# EAGLE design ESP-32-VEZERLO-V1 (EAGLE 6.3)
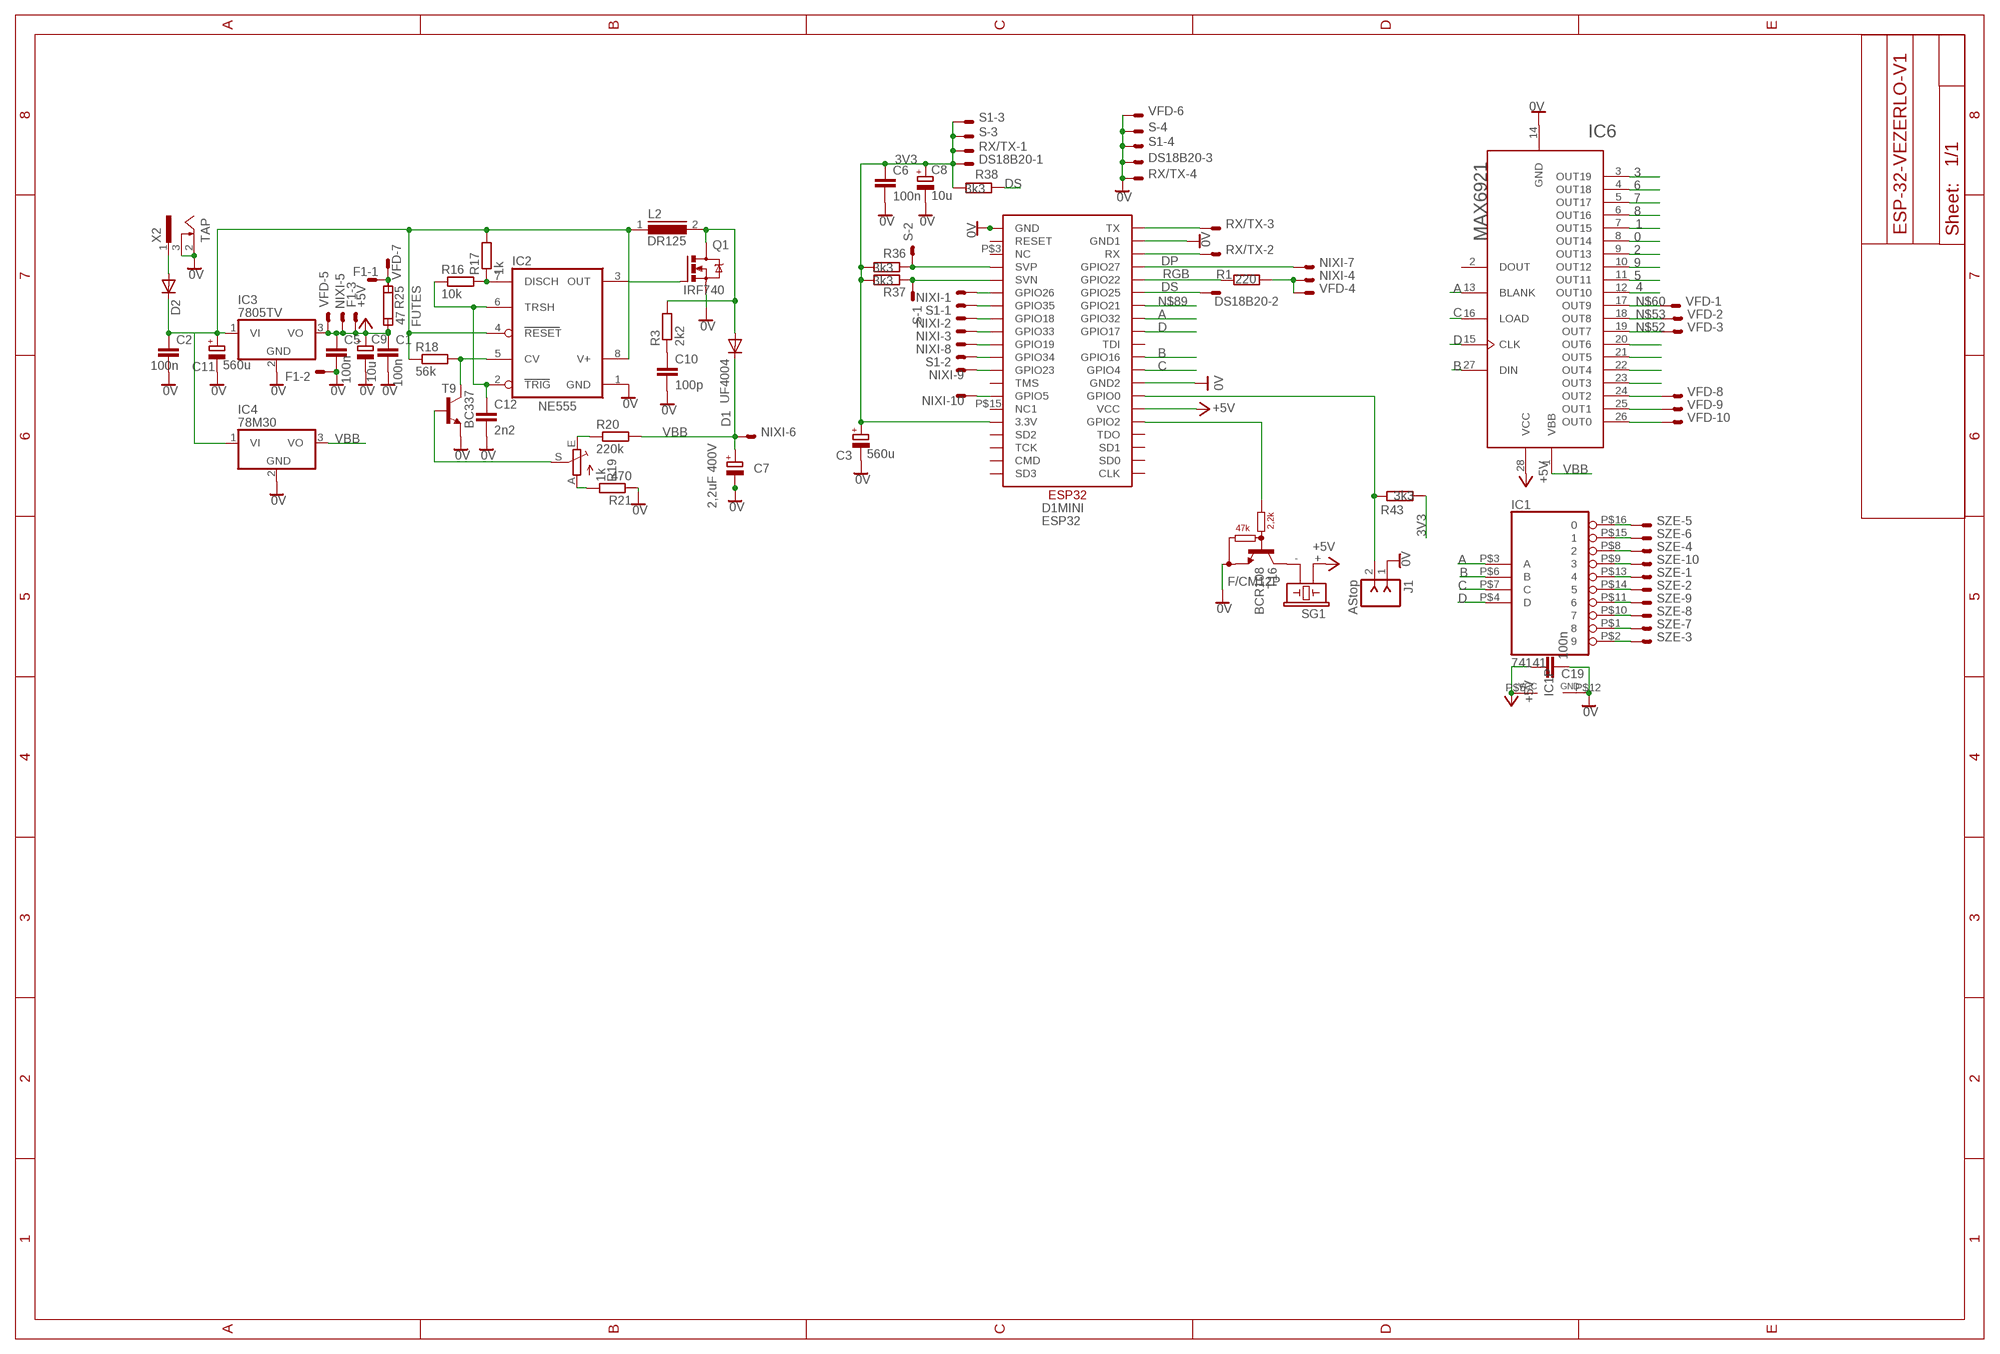
[diagram p0: schematic, sheet 1]

## Parts
C1  100n  C0603  [0603]
C2  100n  C0603  [0603]
C3  560u  CPOL-EUE5-8.5  [E5-8,5]
C5  100n  C0603  [0603]
C6  100n  C0603  [0603]
C7  2,2uF 400V  CPOL-EUE2.5-7  [E2,5-7]
C8  10u  CPOL-EUE2.5-5  [E2,5-5]
C9  10u  CPOL-EUE2.5-5  [E2,5-5]
C10  100p  C-EU050-024X044  [C050-024X044]
C11  560u  CPOL-EUE5-8.5  [E5-8,5]
C12  2n2  C-EUC0603  [C0603]
C19  100n  C0603  [0603]
D1  UF4004  BA221  [DO35-10]
D1MINI  ESP32  ESP32-2X20  [ESP32-2X20]
D2  DIODE-SOD123  [SOD123]
DS18B20  PAD3  [PAD3]
F1  PAD3  [PAD3]
FUTES  47  R-EU_0207/10  [0207/10]
IC1  74141  [DIL16SMD]
IC2  NE555  ICM7555  [DIL08]
IC3  7805TV  [TO220V]
IC4  78M30  7805TV  [TO220V]
IC6  MAX6921  MAX6921SOIC28W  [SO-28W]
J1  AStop  F-1X02-SIP-100-32  [SIP-100-02-32]
L2  DR125  [DR125]
NIXI  PAD10  [PAD10]
Q1  IRF740  [TO220BV]
R1  220  R0603  [0603]
R3  2k2  R-EU_0204/7  [0204/7]
R16  10k  R-EU_R0603  [R0603]
R17  1k  R-EU_R0603  [R0603]
R18  56k  R-EU_R0603  [R0603]
R19  1k  TRIM_EU-CA6H  [CA6H]
R20  220k  R-EU_0204/7  [0204/7]
R21  470  R-EU_0204/7  [0204/7]
R25  RCA0001  [CA0001]
R36  3k3  R0603  [0603]
R37  3k3  R0603  [0603]
R38  3k3  R0603  [0603]
R43  3k3  R0603  [0603]
RX/TX  PAD4  [PAD4]
S  PAD4  [PAD4]
S1  PAD4  [PAD4]
SG1  F/CM12P  [F/CM12P]
SZE  PAD10  [PAD10]
T9  BC337  BC847-NPN-SOT23-BEC  [SOT23-BEC]
T16  BCR108  [SOT23-BEC]
VFD  PAD10  [PAD10]
X2  TAP  [TAP]

## Nets
0: IC1.P$16 IC6.8(OUT14) SZE.P$5
0V: C1.2 C2.2 C3.- C5.2 C6.2 C7.- C8.- C9.- C10.2 C11.- C12.2 C19.2 D1MINI.P$1(GND) D1MINI.P$22(GND1) D1MINI.P$33(GND2) DS18B20.P$3 F1.P$2 IC1.P$12(GND) IC2.1(GND) IC3.2(GND) IC4.2(GND) IC6.14(GND) J1.1 Q1.S R21.1 RX/TX.P$4 S1.P$4 S.P$4 T9.E T16.E VFD.P$6 X2.2 X2.3
1: IC1.P$15 IC6.7(OUT15) SZE.P$6
2: IC1.P$8 IC6.9(OUT13) SZE.P$4
3: IC1.P$9 IC6.3(OUT19) SZE.P$10
3V3: C3.+ C6.1 C8.+ D1MINI.P$16(3.3V) DS18B20.P$1 R36.2 R37.2 R38.2 R43.2 RX/TX.P$1 S1.P$3 S.P$3
4: IC1.P$13 IC6.12(OUT10) SZE.P$1
5: IC1.P$14 IC6.11(OUT11) SZE.P$2
6: IC1.P$11 IC6.4(OUT18) SZE.P$9
7: IC1.P$10 IC6.5(OUT17) SZE.P$8
8: IC1.P$1 IC6.6(OUT16) SZE.P$7
9: IC1.P$2 IC6.10(OUT12) SZE.P$3
+5V: C1.1 C5.1 C9.+ C19.1 D1MINI.P$35(VCC) F1.P$3 FUTES.1 IC1.P$5(VCC) IC3.3(VO) IC6.28(VCC) NIXI.P$5 R25.1 SG1.+ VFD.P$5
A: D1MINI.P$28(GPIO32) IC1.P$3(A) IC6.13(BLANK)
B: D1MINI.P$31(GPIO16) IC1.P$6(B) IC6.27(DIN)
C: D1MINI.P$32(GPIO4) IC1.P$7(C) IC6.16(LOAD)
D: D1MINI.P$29(GPIO17) IC1.P$4(D) IC6.15(CLK)
DP: D1MINI.P$24(GPIO27) NIXI.P$7
DS: D1MINI.P$26(GPIO25) DS18B20.P$2 R38.1
N$1: D1MINI.P$21(TX) RX/TX.P$3
N$2: D1MINI.P$6(GPIO26) NIXI.P$1
N$3: IC6.26(OUT0) VFD.P$10
N$4: IC6.25(OUT1) VFD.P$9
N$6: F1.P$1 FUTES.2 R25.2 VFD.P$7
N$7: D1MINI.P$8(GPIO18) NIXI.P$2
N$8: IC6.24(OUT2) VFD.P$8
N$10: NIXI.P$4 R1.1 VFD.P$4
N$18: R19.E R20.1
N$20: R19.A R21.2
N$22: IC2.3(OUT) Q1.G
N$23: IC2.7(DISCH) R16.2 R17.1
N$24: C12.1 IC2.2(TRIG) IC2.6(TRSH) R16.1
N$26: IC2.5(CV) R18.2 T9.C
N$27: C10.1 R3.1
N$28: D1MINI.P$5(SVN) R37.1 S.P$1
N$43: IC6.23(OUT3)
N$44: D1.A L2.2 Q1.D R3.2
N$46: D1MINI.P$7(GPIO35) S1.P$1
N$49: IC6.22(OUT4)
N$50: IC6.21(OUT5)
N$51: IC6.20(OUT6)
N$52: IC6.19(OUT7) VFD.P$3
N$53: IC6.18(OUT8) VFD.P$2
N$60: IC6.17(OUT9) VFD.P$1
N$70: D2.A X2.1
N$72: D1MINI.P$4(SVP) R36.1 S.P$2
N$73: D1MINI.P$9(GPIO33) NIXI.P$3
N$74: D1MINI.P$10(GPIO19) NIXI.P$8
N$75: D1MINI.P$12(GPIO23) NIXI.P$9
N$76: D1MINI.P$14(GPIO5) NIXI.P$10
N$77: D1MINI.P$36(GPIO2) T16.B
N$79: D1MINI.P$11(GPIO34) S1.P$2
N$80: D1MINI.P$23(RX) RX/TX.P$2
N$89: D1MINI.P$27(GPIO21)
N$92: C2.1 C11.+ D2.C IC2.4(RESET) IC2.8(V+) IC3.1(VI) IC4.1(VI) L2.1 R17.2 R18.1
N$94: SG1.- T16.C
N$96: D1MINI.P$34(GPIO0) J1.2 R43.1
N$119: R19.S T9.B
RGB: D1MINI.P$25(GPIO22) R1.2
VBB: C7.+ D1.C IC4.3(VO) IC6.1(VBB) NIXI.P$6 R20.2
Unconnected: D1MINI.P$2(RESET) D1MINI.P$3(NC) D1MINI.P$13(TMS) D1MINI.P$15(NC1) D1MINI.P$17(SD2) D1MINI.P$18(TCK) D1MINI.P$19(CMD) D1MINI.P$20(SD3) D1MINI.P$30(TDI) D1MINI.P$37(TDO) D1MINI.P$38(SD1) D1MINI.P$39(SD0) D1MINI.P$40(CLK) IC6.2(DOUT)

## Library data of the parts
C1 C2 C5 C6 C19 =  Zozo:C
C3 C7-C9 C11 = resistor:CPOL-EU: POLARIZED CAPACITOR, European symbol
C10 C12 = resistor:C-EU: CAPACITOR, European symbol
D1 = diode:BA221: DIODE high speed (Philips)
D1MINI = ESP32:ESP32-2X20
D2 = diode:DIODE-: DIODE
DS18B20 F1 = tuskesor:PAD3
FUTES R3 R16-R18 R20 R21 = resistor:R-EU_: RESISTOR, European symbol
IC1 = 74xx-eu:74*141: BCD to decimal DECODER/DRIVER
IC2 = maxim1:ICM7555: TIMER; MF: MAXIM; MPN: ICM7555IPA+; OC_FARNELL: 9663762; OC_NEWARK: 68K4387
IC3 IC4 = linear:78*: Positive VOLTAGE REGULATOR Source: http://cache.national.com/ds/LM/LM78L05.pdf http://www.fairchildsemi.com/ds/LM/LM7805.pdf
IC6 = JVN:MAX6921
J1 = con-headers-jp:F-1X02-: FEMALE HEADER
L2 = inductors:DR125: High Power Density, High Efficiency, Shielded Inductors Source: coiltronics_dr_series.pdf
NIXI SZE VFD = tuskesor:PAD10
Q1 = transistor-power:IRF740: N-CHANNEL MOS FET
R1 R36-R38 R43 =  Zozo:R
R19 = pot:TRIM_EU-: POTENTIOMETER
R25 = resistor-power:R: Power Resitor; OC_FARNELL: unknown; OC_NEWARK: unknown
RX/TX S S1 = tuskesor:PAD4
SG1 = buzzer:F/CM12P: BUZZER Source: Buerklin; OC_FARNELL: unknown; OC_NEWARK: unknown
T9 = transistor:*-NPN-: NPN Transistror BF959 corrected 2008.03.06
T16 = digital-transistors:BCR108: NPN Silicon Digital Transistor 50V 0,1A 0,2W
X2 = con-conrad:TAP

## Board
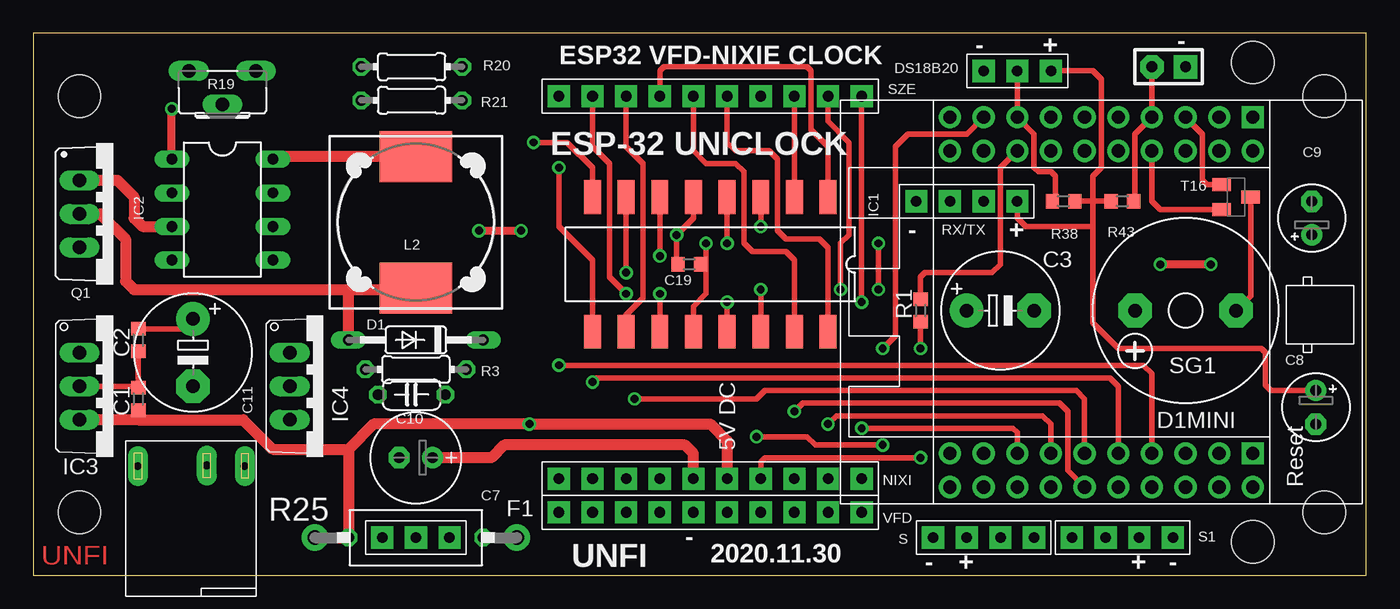
[diagram p1: board, top side]
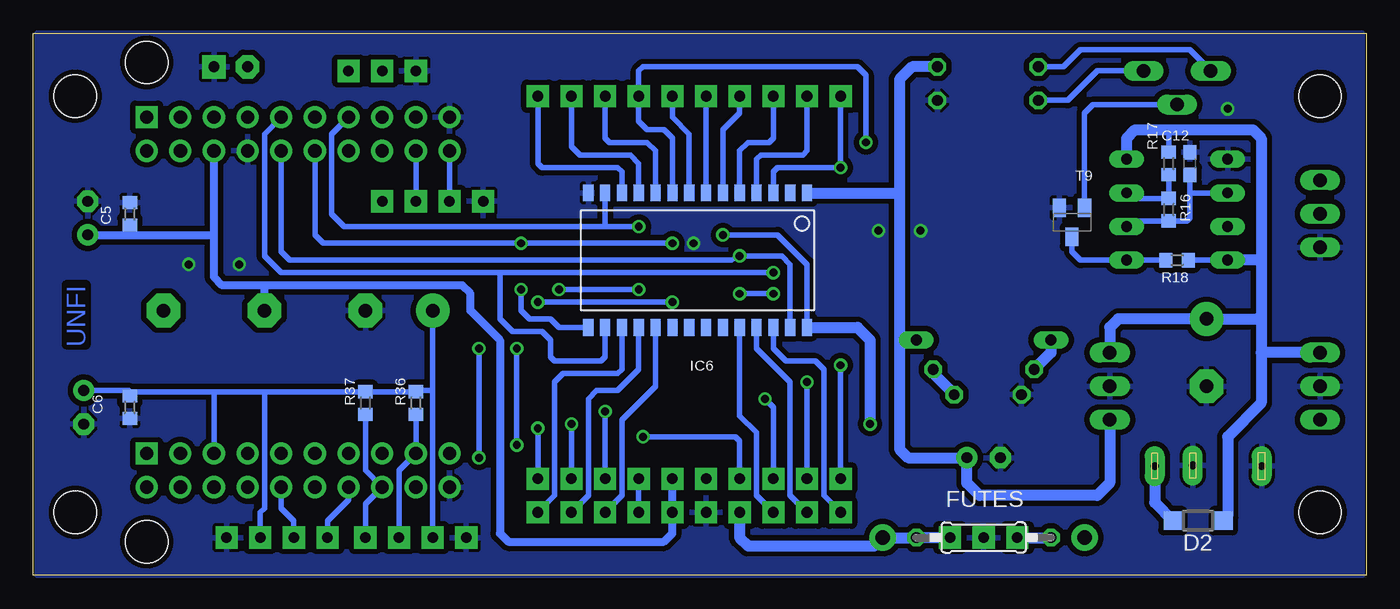
[diagram p2: board, bottom side, seen from below]

Size 100.65 x 40.96 mm. Coordinates in mm from the lower left corner, seen from the top.
Outline: 0,0 100.65,0 100.65,40.96 0,40.96 0,0
Copper layers (1*16): Top 0.035mm / dielectric 1.5mm / Bottom 0.035mm
Design rules "default *": minimum track width 10mil, minimum drill 24mil, track to track 8mil, track to pad 8mil, pad to pad 8mil, via to via 8mil, smd to smd 8mil, copper to edge 0mil, drill to drill 8mil, minimum pad ring 10mil, minimum via ring 8mil, stop-mask expansion 4mil, vias tented up to drill 0mil, thermal gap 10mil
Holes 3.2 mm at 3.49,36.2 3.49,4.76 92.07,2.54 92.07,38.74 97.47,36.2 97.47,4.76

### Footprints (pad centres in the part's own frame; a part is rotated, then mirrored left to right if it is on the bottom)
0603 = smd 1 x 1.1: 1 -0.85,0; 2 0.85,0
E5-8,5 = drill 1.016 pad 2.54: + -2.54,0 | drill 1.016 pad 2.54 octagon: - 2.54,0
E2,5-7 = drill 0.813 pad 1.6: + -1.27,0 | drill 0.813 pad 1.6 octagon: - 1.27,0
E2,5-5 = drill 0.813 pad 1.6: + -1.27,0 | drill 0.813 pad 1.6 octagon: - 1.27,0
C050-024X044 = drill 0.813 octagon: 1 -2.54,0; 2 2.54,0
C0603 = smd 1.1 x 1: 1 -0.85,0; 2 0.85,0
DO35-10 = drill 0.813 long: A 5.08,0; C -5.08,0
ESP32-2X20 = drill 1 pad 1.676: P$1 -12.7,10.16; P$2 -10.16,10.16; P$3 -12.7,7.62; P$4 -10.16,7.62; P$5 -12.7,5.08; P$6 -10.16,5.08; P$7 -12.7,2.54; P$8 -10.16,2.54; P$9 -12.7,0; P$10 -10.16,0; P$11 -12.7,-2.54; P$12 -10.16,-2.54; P$13 -12.7,-5.08; P$14 -10.16,-5.08; P$15 -12.7,-7.62; P$16 -10.16,-7.62; P$17 -12.7,-10.16; P$18 -10.16,-10.16; P$19 -12.7,-12.7; P$21 12.7,10.16; P$22 15.24,10.16; P$23 12.7,7.62; P$24 15.24,7.62; P$25 12.7,5.08; P$26 15.24,5.08; P$27 12.7,2.54; P$28 15.24,2.54; P$29 12.7,0; P$30 15.24,0; P$31 12.7,-2.54; P$32 15.24,-2.54; P$33 12.7,-5.08; P$34 15.24,-5.08; P$35 12.7,-7.62; P$36 15.24,-7.62; P$37 12.7,-10.16; P$38 15.24,-10.16; P$39 12.7,-12.7 | drill 1 pad 1.676 square: P$20 -10.16,-12.7; P$40 15.24,-12.7
SOD123 = smd 1.4 x 1.4: A 1.9,0; C -1.9,0
PAD3 = drill 0.8 pad 1.676 square: P$1 0,0; P$2 2.54,0; P$3 5.08,0
0207/10 = drill 0.813 octagon: 1 -5.08,0; 2 5.08,0
DIL16SMD = smd 1.27 x 2.54: P$1 0,0; P$2 2.54,0; P$3 5.08,0; P$4 7.62,0; P$5 10.16,0; P$6 12.7,0; P$7 15.24,0; P$8 17.78,0; P$9 17.78,10.16; P$10 15.24,10.16; P$11 12.7,10.16; P$12 10.16,10.16; P$13 7.62,10.16; P$14 5.08,10.16; P$15 2.54,10.16; P$16 0,10.16
DIL08 = drill 0.813 long: 1 -3.81,-3.81; 2 -1.27,-3.81; 3 1.27,-3.81; 4 3.81,-3.81; 5 3.81,3.81; 6 1.27,3.81; 7 -1.27,3.81; 8 -3.81,3.81
TO220V = drill 1.016 long: 1 -2.54,-2.54; 2 0,-2.54; 3 2.54,-2.54
SO-28W = smd 0.762 x 1.27: 1 -8.255,-5.08; 2 -6.985,-5.08; 3 -5.715,-5.08; 4 -4.445,-5.08; 5 -3.175,-5.08; 6 -1.905,-5.08; 7 -0.635,-5.08; 8 0.635,-5.08; 9 1.905,-5.08; 10 3.175,-5.08; 11 4.445,-5.08; 12 5.715,-5.08; 13 6.985,-5.08; 14 8.255,-5.08; 15 8.255,5.08; 16 6.985,5.08; 17 5.715,5.08; 18 4.445,5.08; 19 3.175,5.08; 20 1.905,5.08; 21 0.635,5.08; 22 -0.635,5.08; 23 -1.905,5.08; 24 -3.175,5.08; 25 -4.445,5.08; 26 -5.715,5.08; 27 -6.985,5.08; 28 -8.255,5.08
SIP-100-02-32 = drill 0.813 pad 1.778 square: 1 -1.27,0 | drill 0.813 pad 1.778 octagon: 2 1.27,0
DR125 = smd 3.85 x 5.5: 1 -4.975,0; 2 4.975,0
PAD10 = drill 0.8 pad 1.676 square: P$1 0,0; P$2 2.54,0; P$3 5.08,0; P$4 7.62,0; P$5 10.16,0; P$6 12.7,0; P$7 15.24,0; P$8 17.78,0; P$9 20.32,0; P$10 22.86,0
TO220BV = drill 1.016 long: D 0,-2.54; G -2.54,-2.54; S 2.54,-2.54
0204/7 = drill 0.813 octagon: 1 -3.81,0; 2 3.81,0
R0603 = smd 1 x 1.1: 1 -0.85,0; 2 0.85,0
CA6H = drill 1.016 long: A -2.54,0; E 2.54,0; S 0,2.54
CA0001 = drill 1.1 pad 2: 1 -7.62,0; 2 7.62,0
PAD4 = drill 0.8 pad 1.676 square: P$1 0,0; P$2 2.54,0; P$3 5.08,0; P$4 7.62,0
F/CM12P = drill 1.016 pad 2.54 octagon: + 3.81,0; - -3.81,0
SOT23-BEC = smd 1 x 1.4: B -0.95,-1.1; C 0,1.1; E 0.95,-1.1
TAP = drill 0.6 pad 1.5 long: 1 -4.55,0; 2 3.525,0; 3 -1.676,-0.04

### Placement (x,y rotation side)
C1  7.94,13.34 90 top
C2  7.94,17.78 270 top
C3  73.02,20 0 top
C5  93.34,27.3 90 bottom
C6  93.34,12.7 270 bottom
C7  28.89,8.89 180 top
C8  96.84,12.7 270 top
C9  96.52,26.99 90 top
C10  28.57,13.65 180 top
C11  12.07,16.83 270 top
C12  13.34,31.12 90 bottom
C19  49.53,23.5 0 top
D1  28.89,17.78 180 top
D1MINI  79.38,19.37 90 top
D2  12.7,4.13 180 bottom
DS18B20  76.83,38.1 180 top
F1  31.43,2.86 180 top
FUTES  28.89,2.86 180 bottom
IC1  60.01,28.58 180 top
IC2  14.29,27.62 270 top
IC3  6.03,14.29 270 top
IC4  21.91,14.29 270 top
IC6  50.48,23.81 180 bottom
J1  85.72,38.42 180 top
L2  28.89,26.67 270 top
NIXI  62.55,7.3 180 top
Q1  6.03,27.3 270 top
R1  66.99,20 90 top
R3  28.89,15.56 180 top
R16  14.92,27.62 90 bottom
R17  14.92,31.12 90 bottom
R18  14.29,23.81 180 bottom
R19  14.29,38.1 180 top
R20  28.57,38.42 0 top
R21  28.57,35.88 180 top
R25  28.89,2.86 0 top
R36  71.75,13.02 90 bottom
R37  75.56,13.02 90 bottom
R38  77.79,28.26 0 top
R43  82.23,28.26 180 top
RX/TX  74.3,28.26 180 top
S  75.56,2.86 180 top
S1  78.42,2.86 0 top
SG1  86.99,20 180 top
SZE  62.55,36.2 180 top
T9  22.22,26.67 180 bottom
T16  90.8,28.58 270 top
VFD  62.55,4.76 180 top
X2  11.43,8.26 180 top

### Tracks (layer width: path | path; a pad name or v marks a point on that pad's centre or on a via)
0
  Top 0.406: IC1.P$16 60.01,24.77 59.37,25.4 56.83,25.4 56.2,26.04 56.2,31.43 55.56,32.07 53.02,32.07 52.39,32.7 SZE.P$5
  Bottom 0.406: IC6.8 51.12,33.34 52.39,34.61 SZE.P$5
0V  (via drill 0.6)
  Top 0.406: IC1.P$12 49.85,20.32 50.8,21.27 50.8,23.5 | 50.8,23.5 v50.8,25.08 | C19.2 50.8,23.5 | D1MINI.P$33 84.46,28.26 85.09,27.62 T16.E | C2.2 C1.2 7.84,14.29 IC3.2
  Top 0.61: IC2.1 v10.48,35.24 | v33.65,26.04 v36.83,26.04 | v88.9,23.5 v85.09,23.5
  pour Bottom (isolate 0.406): 0.32,0 100.33,0 100.33,40.96 0.32,40.96
1
  Top 0.406: IC1.P$15 57.47,23.81 56.83,24.45 54.29,24.45 53.66,25.08 53.66,30.48 53.02,31.12 50.8,31.12 49.85,32.07 SZE.P$6
  Bottom 0.406: IC6.7 SZE.P$6
2  (via drill 0.6)
  Top 0.406: v37.78,32.7 40.32,32.7 42.23,30.8 IC1.P$8
  Bottom 0.406: IC6.9 52.39,33.02 53.02,33.66 54.29,33.66 54.93,34.29 SZE.P$4 54.93,38.1 54.61,38.42 38.42,38.42 37.78,37.78 v37.78,32.7
3  (via drill 0.6)
  Top 0.406: IC1.P$9 42.23,23.81 39.69,26.35 v39.69,30.8
  Bottom 0.406: IC6.3 44.77,30.48 44.45,30.8 v39.69,30.8 SZE.P$10
3V3
  Top 0.406: R43.2 80.01,28.26 | 80.01,28.26 80.01,30.16 80.65,30.8 80.65,37.47 80.01,38.1 DS18B20.P$1 | RX/TX.P$1 74.3,26.99 74.93,26.35 80.01,26.35 | 80.01,28.26 R38.2 | 80.01,26.35 80.01,28.26 | 80.01,26.35 80.01,19.05 81.91,17.15 92.71,17.15 93.03,16.83 93.03,14.39 93.45,13.97 C8.+
  Bottom 0.406: 70.49,13.97 71.65,13.97 R36.2 R37.2 83.19,13.87 | 83.19,13.87 86.99,13.87 | 83.19,13.87 83.19,5.08 83.5,4.76 S1.P$3 | D1MINI.P$16 86.99,13.87 | S.P$3 70.49,13.97 | 86.99,13.87 93.35,13.87 C6.1 93.45,13.97 C8.+ | 70.49,13.97 C3.+
4  (via drill 0.6)
  Top 0.406: IC1.P$13 v52.39,20.64 | v62.55,20.64 SZE.P$1
  Bottom 0.406: v52.39,20.64 v62.55,20.64 | IC6.12 56.2,30.48 56.51,30.8 62.23,30.8 62.55,31.12 SZE.P$1
5  (via drill 0.6)
  Top 0.406: IC1.P$14 v54.93,21.59 | v60.96,21.59 60.96,25.08 61.6,25.72 61.6,32.7 60.01,34.29 SZE.P$2
  Bottom 0.406: IC6.11 54.93,31.12 55.56,31.75 59.37,31.75 60.01,32.38 SZE.P$2 | v54.93,21.59 v60.96,21.59
6  (via drill 0.6)
  Top 0.406: SZE.P$9 42.23,32.38 43.5,31.12 43.5,22.54 v44.77,21.27 | IC1.P$11 v47.31,21.27
  Bottom 0.406: IC6.4 46.04,31.43 45.72,31.75 42.54,31.75 42.23,32.07 SZE.P$9 | v47.31,21.27 v44.77,21.27
7
  Top 0.406: IC1.P$10 44.77,19.69 46.04,20.95 46.04,31.12 44.77,32.38 SZE.P$8
  Bottom 0.406: IC6.5 47.31,32.07 46.67,32.7 45.08,32.7 44.77,33.02 SZE.P$8
8
  Top 0.406: SZE.P$7 47.31,38.1 47.62,38.42 58.42,38.42 58.74,38.1 58.74,33.66 60.01,32.38 IC1.P$1
  Bottom 0.406: IC6.6 48.58,33.66 47.31,34.93 SZE.P$7
9
  Top 0.406: SZE.P$3 IC1.P$2
  Bottom 0.406: IC6.10 53.66,32.07 54.29,32.7 57.15,32.7 57.47,33.02 SZE.P$3
+5V  (via drill 0.6)
  Top 0.406: IC1.P$5 49.85,26.99 v48.58,25.72 48.58,23.6 C19.1 | C1.1 7.94,11.75
  Top 0.813: NIXI.P$5 52.39,10.16 51.12,11.43 v37.47,11.43 25.72,11.43 23.81,9.52 | IC3.3 7.94,11.75 15.87,11.75 18.1,9.52 23.81,9.52 | 23.81,9.52 FUTES.1 R25.1
  Bottom 0.406: v48.58,25.72 44.45,25.72 42.23,23.5 IC6.28
  Bottom 0.61: 86.99,25.72 86.99,22.54 86.36,21.91 83.19,21.91 | 86.99,25.72 D1MINI.P$35 | NIXI.P$5 VFD.P$5 52.39,3.18 53.02,2.54 64.77,2.54 65.41,3.18 65.41,17.78 67.63,20 67.63,21.27 68.26,21.91 83.19,21.91 | C9.+ 93.35,25.72 | 93.35,25.72 86.99,25.72 | C5.1 93.35,25.72 | SG1.+ 83.19,21.91
  Bottom 0.813: IC6.28 38.42,18.73 37.47,17.78 v37.47,11.43 | F1.P$3 FUTES.1
A  (via drill 0.6)
  Top 0.406: IC1.P$3 v54.93,26.35
  Bottom 0.406: v54.93,26.35 57.47,26.35 | 57.47,26.35 77.15,26.35 78.1,27.3 78.1,33.34 D1MINI.P$28 | IC6.13 57.47,26.35
B  (via drill 0.6)
  Top 0.406: v47.31,24.13 IC1.P$6
  Bottom 0.406: IC6.27 43.5,23.5 44.13,24.13 v47.31,24.13 47.94,23.81 81.28,23.81 81.91,24.45 D1MINI.P$31
C  (via drill 0.6)
  Top 0.406: IC1.P$7 v44.77,22.86
  Bottom 0.406: 65.41,22.86 81.91,22.86 83.19,24.13 83.19,33.34 D1MINI.P$32 | IC6.16 57.47,16.51 57.79,16.19 61.28,16.19 61.6,16.51 61.6,17.78 62.23,18.41 64.45,18.41 65.41,19.37 65.41,22.86 | 65.41,22.86 v44.77,22.86
D  (via drill 0.6)
  Top 0.406: IC1.P$4 v52.39,25.08 | v63.82,21.59 v63.82,25.08
  Bottom 0.406: v52.39,25.08 v63.82,25.08 78.74,25.08 79.38,25.72 D1MINI.P$29 | IC6.15 60.96,18.73 61.6,19.37 63.18,19.37 63.82,20 v63.82,21.59
DP  (via drill 0.6)
  Top 0.406: v64.14,9.84 59.05,9.84 58.42,10.48 v54.61,10.48 | D1MINI.P$24 70.49,33.34 66.04,33.34 65.09,32.38 65.09,18.1 v64.14,17.15
  Bottom 0.406: v64.14,9.84 v64.14,17.15 | NIXI.P$7 47.31,10.16 47.62,10.48 v54.61,10.48
DS
  Top 0.406: DS18B20.P$2 D1MINI.P$26 75.57,33.34 75.57,30.8 75.88,30.48 76.83,30.48 77.15,30.16 77.15,28.36 R38.1
N$1
  Bottom 0.406: D1MINI.P$21 RX/TX.P$3
N$2  (via drill 0.6)
  Top 0.406: v62.55,11.11 73.98,11.11 74.3,10.8 D1MINI.P$6
  Bottom 0.406: NIXI.P$1 v62.55,11.11
N$3
  Bottom 0.406: VFD.P$10 40.96,6.03 40.96,15.56 41.59,16.19 43.82,16.19 44.77,17.15 IC6.26
N$4
  Bottom 0.406: VFD.P$9 43.5,6.03 43.5,14.61 46.04,17.15 IC6.25
N$6
  Bottom 0.813: VFD.P$7 47.31,2.86 46.67,2.22 37.15,2.22 R25.2 FUTES.2 F1.P$1
N$7  (via drill 0.6)
  Top 0.406: D1MINI.P$8 76.83,11.43 76.2,12.07 60.64,12.07 v60.01,11.43
  Bottom 0.406: NIXI.P$2 v60.01,11.43
N$8
  Bottom 0.406: VFD.P$8 46.04,6.03 46.04,10.8 47.31,12.07 IC6.24
N$10  (via drill 0.6)
  Top 0.406: NIXI.P$4 54.93,8.57 55.25,8.89 v66.99,8.89 | R1.1 v66.99,17.15
  Bottom 0.406: VFD.P$4 NIXI.P$4 | v66.99,8.89 v66.99,17.15
N$18
  Bottom 0.406: R20.1 22.86,38.42 21.59,39.69 13.34,39.69 R19.E
N$20
  Bottom 0.406: R19.A 20.32,38.1 22.54,35.88 R21.2
N$22
  Top 0.813: Q1.G 6.35,29.84 7.62,28.58 7.62,26.99 8.26,26.35 IC2.3
N$23
  Bottom 0.406: R17.1 R16.2 17.68,28.47 IC2.7
N$24
  Bottom 0.406: IC2.6 17.68,26.77 R16.1 13.55,26.77 13.34,26.99 13.34,28.89 | 13.34,28.89 C12.1 | IC2.2 13.34,28.89
N$26
  Bottom 0.406: R18.2 IC2.5 21.59,23.81 22.22,24.45 T9.C
N$27
  Bottom 0.813: R3.1 32.7,15.24 C10.1
N$28
  Bottom 0.406: R37.1 75.57,7.94 D1MINI.P$5 75.57,5.4 S.P$1
N$44
  Top 0.813: 23.81,21.59 28.79,21.59 L2.2 | D1.A 23.81,21.59 | Q1.D 5.08,27.3 6.99,25.4 6.99,22.23 7.62,21.59 23.81,21.59
  Bottom 0.813: D1.A 23.81,16.83 R3.2
N$46
  Bottom 0.406: D1MINI.P$7 76.83,5.71 78.42,4.13 S1.P$1
N$52
  Bottom 0.406: IC6.19 53.66,14.29 56.2,11.75 56.2,6.03 VFD.P$3
N$53
  Bottom 0.406: IC6.18 54.93,15.56 56.51,13.97 58.1,13.97 58.74,13.34 58.74,6.03 VFD.P$2
N$60
  Bottom 0.406: IC6.17 56.2,15.56 56.51,15.24 60.64,15.24 61.28,14.61 61.28,6.03 VFD.P$1
N$70
  Bottom 0.813: X2.1 15.98,5.51 D2.A
N$72
  Bottom 0.406: R36.1 D1MINI.P$4 73.02,7.94 S.P$2
N$73  (via drill 0.6)
  Top 0.406: D1MINI.P$9 78.1,7.94 78.1,12.38 77.47,13.02 58.1,13.02 v57.47,12.38
  Bottom 0.406: NIXI.P$3 v57.47,12.38
N$74  (via drill 0.6)
  Top 0.406: D1MINI.P$10 79.38,13.34 78.74,13.97 55.25,13.97 54.61,13.34 v45.4,13.34
  Bottom 0.406: NIXI.P$8 44.77,12.7 v45.4,13.34
N$75  (via drill 0.6)
  Top 0.406: D1MINI.P$12 81.91,14.29 81.28,14.92 42.54,14.92 v42.23,14.61
  Bottom 0.406: NIXI.P$9 v42.23,14.61
N$76  (via drill 0.6)
  Top 0.406: v39.69,15.88 83.82,15.88 84.46,15.24 D1MINI.P$14
  Bottom 0.406: NIXI.P$10 v39.69,15.88
N$77
  Top 0.406: D1MINI.P$36 88.27,33.34 88.27,29.84 88.58,29.52 T16.B
N$79
  Bottom 0.406: D1MINI.P$11 81.91,5.08 80.96,4.13 S1.P$2
N$80
  Bottom 0.406: D1MINI.P$23 RX/TX.P$2
N$92
  Top 0.406: C2.1 11.33,18.63 C11.+
  Top 0.813: L2.1 18.31,31.65 IC2.8
  Bottom 0.406: R18.1 IC2.4 | R17.2 14.92,33.34 15.24,33.66
  Bottom 0.813: 7.94,23.81 IC2.4 | IC2.8 18.1,33.02 17.46,33.66 15.24,33.66 8.57,33.66 7.94,33.02 7.94,23.81 | 7.94,23.81 7.94,19.69 | 7.94,19.69 7.94,16.83 | IC3.1 7.94,16.83 | 7.94,19.69 8.26,19.37 C11.+ 18.73,19.37 19.37,18.73 IC4.1 | 7.94,16.83 7.94,13.02 10.48,10.48 10.48,4.45 D2.C
N$94
  Top 0.406: T16.C 91.91,21.1 SG1.-
N$96
  Top 0.406: R43.1 83.19,28.68 83.19,33.34 D1MINI.P$34 J1.2
N$119
  Bottom 0.406: R19.S 20.64,35.56 21.27,34.93 T9.B
RGB
  Top 0.406: D1MINI.P$25 73.02,30.8 73.02,23.5 72.39,22.86 67.31,22.86 66.99,22.54 R1.2
VBB
  Top 0.813: NIXI.P$6 49.85,9.21 49.21,9.84 35.56,9.84 34.61,8.89 C7.+
  Bottom 0.813: IC6.1 35.24,28.89 | 35.24,28.89 35.24,17.78 | R20.2 34.29,38.42 35.24,37.47 35.24,28.89 | D1.C 35.24,17.78 | 35.24,17.78 35.24,9.52 34.61,8.89 C7.+ 30.16,6.98 29.21,6.03 20.32,6.03 19.37,6.98 IC4.3

### Text on the board
Top: UNFI
Bottom: UNFI
tPlace: ESP32 VFD-NIXIE CLOCK | - | + | - | ESP-32 UNICLOCK | - | + | 5V DC | - | UNFI | 2020.11.30 | - | + | + | -